# Altium schematic sheet Driver5.SchDoc
size A4; SheetNumber: 7; SheetTotal: 8
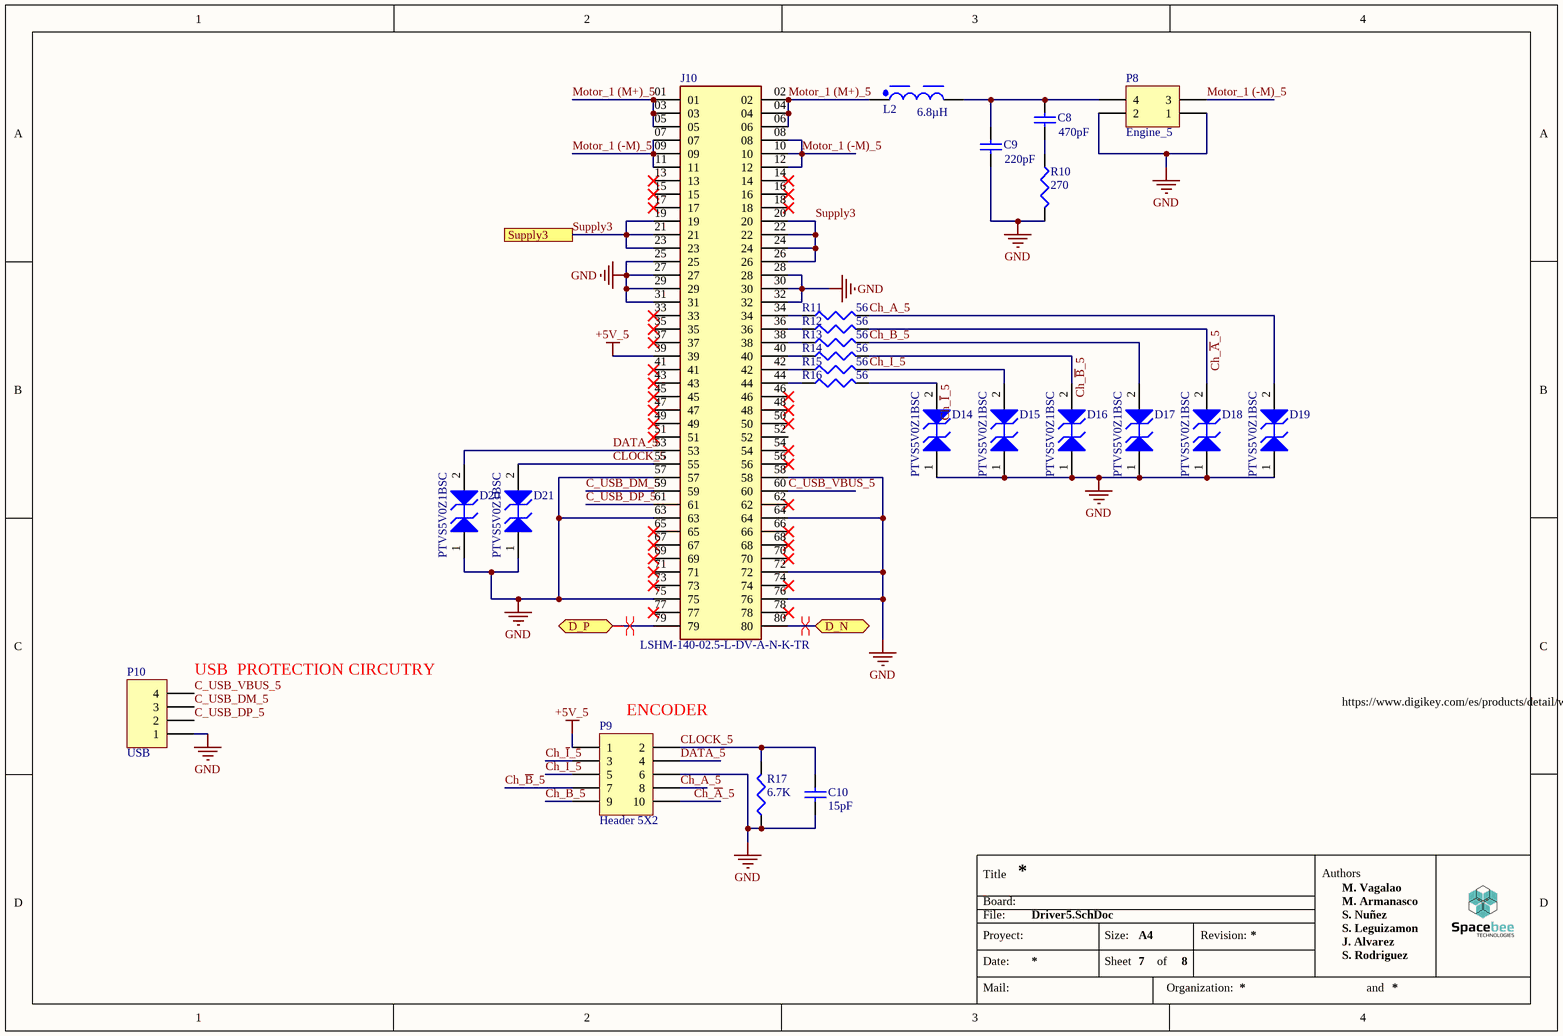
[diagram p0: Driver5.SchDoc]

## Parts
C8  value 470pF  [1608[0603]]  (hidden comment: Cap Semi)
C9  value 220pF  [1608[0603]]  (hidden comment: Cap Semi)
C10  value 15pF  [6-0805_L]  (hidden comment: Cap Semi)
D14  PTVS5V0Z1BSC  [SOD993B]
D15  PTVS5V0Z1BSC  [SOD993B]
D16  PTVS5V0Z1BSC  [SOD993B]
D17  PTVS5V0Z1BSC  [SOD993B]
D18  PTVS5V0Z1BSC  [SOD993B]
D19  PTVS5V0Z1BSC  [SOD993B]
D20  PTVS5V0Z1BSC  [SOD993B]
D21  PTVS5V0Z1BSC  [SOD993B]
J10  LSHM-140-02.5-L-DV-A-N-K-TR  [SAMTEC_LSHM-140-02.5-L-DV-A-N-K-TR]
L2  6.8µH  [WE-XHMA_6060]
P8  Engine_5  [MOLEX_1724480004]
P9  Header 5X2  [CONN_HIF3FC-14PA-2.54DS(71)_HIR]
P10  USB  [Header 4 SMD]
R10  value 270  [J1-0603]  (hidden comment: Res3)
R11  value 56  [J1-0603]  (hidden comment: Res3)
R12  value 56  [J1-0603]  (hidden comment: Res3)
R13  value 56  [J1-0603]  (hidden comment: Res3)
R14  value 56  [J1-0603]  (hidden comment: Res3)
R15  value 56  [J1-0603]  (hidden comment: Res3)
R16  value 56  [J1-0603]  (hidden comment: Res3)
R17  value 6.7K  [J1-0603]  (hidden comment: Res3)

## Ports
D_N (bidir), D_P (bidir), Supply3

## Nets
+5V_5: J10.39 P9.1
GND: C9.2 C10.1 D14.1(A1) D15.1(A1) D16.1(A1) D17.1(A1) D18.1(A1) D19.1(A1) D20.1(A1) D21.1(A1) J10.25 J10.27 J10.28 J10.29 J10.30 J10.31 J10.32 J10.57 J10.58 J10.63 J10.64 J10.72 J10.75 J10.76 P8.1 P8.2 P9.6 P10.1 R10.2 R17.1
C_USB_DM_5: J10.59 P10.3
C_USB_DP_5: J10.61 P10.2
C_USB_VBUS_5: J10.60 P10.4
Ch_~{A}_5: D18.2(A2) P9.10 R12.2
Ch_A_5: D19.2(A2) P9.8 R11.2
Ch_~{B}_5: D16.2(A2) P9.7 R14.2
Ch_B_5: D17.2(A2) P9.9 R13.2
Ch_~{I}_5: D14.2(A2) P9.3 R16.2
Ch_I_5: D15.2(A2) P9.5 R15.2
CLOCK_5: C10.2 D21.2(A2) J10.55 P9.2 R17.2
D_N: J10.80 ; port D_N
D_P: J10.79 ; port D_P
DATA_5: D20.2(A2) J10.53 P9.4
Motor_1 (-M)_5: J10.07 J10.08 J10.09 J10.10 J10.11 J10.12 P8.3
Motor_1 (M+)_5: J10.01 J10.02 J10.03 J10.04 J10.05 J10.06 L2.1
Supply3: J10.19 J10.20 J10.21 J10.22 J10.23 J10.24 J10.26 ; port Supply3
NetC8_1: C8.1 C9.1 L2.2 P8.4
NetC8_2: C8.2 R10.1
NetJ10_34: J10.34 R11.1
NetJ10_36: J10.36 R12.1
NetJ10_38: J10.38 R13.1
NetJ10_40: J10.40 R14.1
NetJ10_42: J10.42 R15.1
NetJ10_44: J10.44 R16.1

Not connected (* = marked no-connect by the designer): J10 13* 14* 15* 16* 17* 18* 33* 35* 37* 41* 43* 45* 46* 47* 48* 49* 50* 51* 52 54* 56* 62* 65* 66* 67* 68* 69* 70* 71* 73* 74* 77* 78*

## Layout directives
differential pair: D_N, D_P

## Notes on the sheet
- (near P10) USB  PROTECTION CIRCUTRY
- (near P9) ENCODER
- https://www.digikey.com/es/products/detail/würth-elektronik/9774050243R/5320640?s=N4IgTCBcDaIJwHYEBYAMBWVZkGYBKIAugL5A
- Title
- Board:
- File:
- Authors
- M. Armanasco
- S. Nuñez
- M. Vagalao
- Proyect:
- Date:
- Mail:
- Size:
- Sheet
- A4
- of
- Organization:
- Revision:
- S. Rodriguez
- S. Leguizamon
- J. Alvarez
- and

## Library data of the parts
C8 C9 = Cap Semi: Capacitor (Semiconductor SIM Model); Published: 8-Jun-2000; LatestRevisionDate: 29-May-2009; LatestRevisionNote: IPC-7351 Footprint Added.; PackageReference: C1206; Publisher: Altium Limited; PackageDescription: Chip Capacitor
C10 = Cap 0805: Capacitor (Semiconductor SIM Model); Published: 8-Jun-2000; LatestRevisionDate: 29-May-2009; LatestRevisionNote: IPC-7351 Footprint Added.; PackageReference: C1206; Publisher: Altium Limited; PackageDescription: Chip Capacitor
D14-D21 = PTVS5V0Z1BSC: Manufacturer: On Semiconductor; PartNumber: 1SMB16CAT3; Direction: Bidirectional; IR Max (uA): 5; Packing: Tape and Reel; PPK Max (W): 600; V(BR) Typ (V): 18.74; DatasheetVersion: Rev. A; PackageVersion: Rev. A, 01/2000; PackageReference: SMB-2-403C-01; PackageDescription: 2-Pin Small Molded Package, J-Bend Lead, Body 4.315 x 3.555 mm; Supplier 1: Digi-Key; Supplier Part Number 1: 1SMB16CAT3OSTR-ND; Supplier 2: Digi-Key; Supplier Part Number 2: 1SMB16CAT3OSCT-ND; Supplier 3: Digi-Key; Supplier Part Number 3: 1SMB16CAT3OSDKR-ND; Mounting Technology: Surface Mount; ComponentLink1Description: Manufacturer URL; ComponentLink1URL: http://www.onsemi.com/; ComponentLink2Description: Datasheet; ComponentLink2URL: http://www.onsemi.com/pub_link/Collateral/1SMB10CAT3-D.PDF; ComponentLink3Description: Package Specification; ComponentLink3URL: http://www.onsemi.com/pub_link/Collateral/1SMB10CAT3-D.PDF
J10 = LSHM-140-02.5-L-DV-A-N-K-TR: LSHM - Samtec 0.50mm Razor Beam High-Speed Hermaphroditic Terminal / Socket Strip.; Price: None; MP: LSHM-140-02.5-L-DV-A-N-K-TR; Availability: Unavailable; Value: *; Package: None
L2 = 78439369068: WE-XHMA SMD Power Inductor, size 1090, 6.8µH, 10.5A, 7.16mΩ; Manufacturer: Wurth Elektronik; Case/Size Code: 1090; Inductance Tolerance: 20%; Saturation Current: 23.25A; Self Resonant Frequency: 16MHz; ComponentLink1Description: Website Link; ComponentLink1URL: https://www.we-online.com/redexpert/article/78439369068?ad; ComponentLink2Description: Datasheet Link; ComponentLink2URL: https://www.we-online.com/redexpert/spec/78439369068?ad; Manufacturer Part Number: 78439369068; Category: Shielded Power Inductors; Match Code: WE-XHMA; Mount: Surface Mount; Operating Temperature Max: 125°C; Operating Temperature Min: -40°C; Packaging: Tape and Reel; Length: 11.6mm; Width: 10.5mm; Height: 8.8mm; DC Resistance: 7.16mΩ; Inductance: 6.8µH; Rated Current: 10.5A
P8 = Header 2X2: Header, 2-Pin, Dual row; LatestRevisionDate: 17-Jul-2002; LatestRevisionNote: Re-released for DXP Platform.; Publisher: Altium Limited
P9 = Header 5X2: Header, 5-Pin, Dual row; LatestRevisionDate: 17-Jul-2002; LatestRevisionNote: Re-released for DXP Platform.; Publisher: Altium Limited
P10 = Header 4 SMD: Header, 4-Pin; LatestRevisionDate: 17-Jul-2002; LatestRevisionNote: Re-released for DXP Platform.; Publisher: Altium Limited
R10-R17 = Res3: Resistor; Published: 8-Jun-2000; LatestRevisionDate: 29-May-2009; LatestRevisionNote: IPC-7351 Footprint Added.; PackageReference: J1-0603; Publisher: Altium Limited; PackageDescription: Chip Resistor